# EAGLE design MegaTinyTimeWatch (EAGLE 7.6.0)
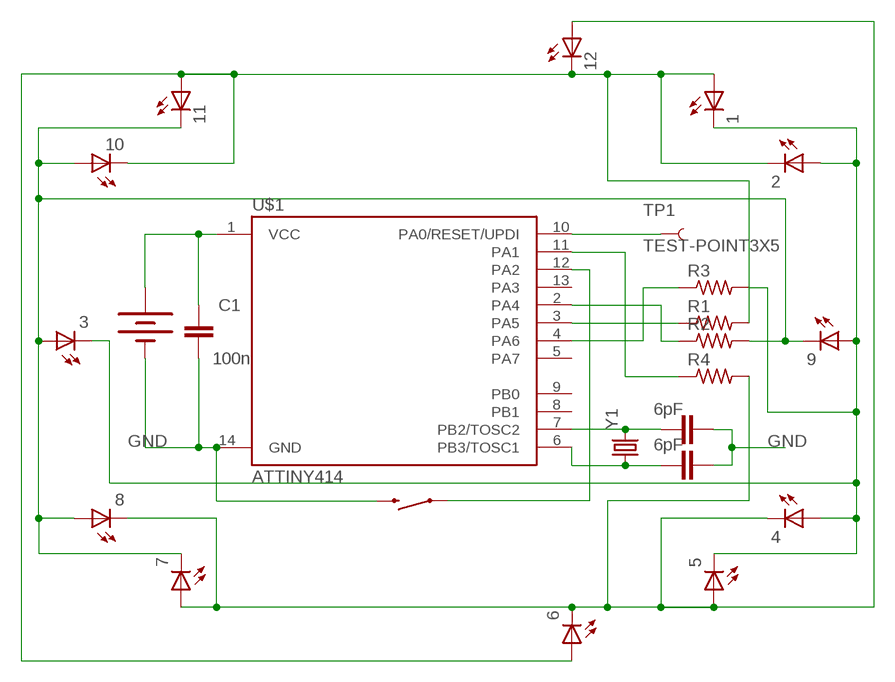
[diagram p0: schematic, sheet 1]

## Parts
1  LEDCHIPLED_0805  [CHIPLED_0805]
2  LEDCHIPLED_0805  [CHIPLED_0805]
3  LEDCHIPLED_0805  [CHIPLED_0805]
4  LEDCHIPLED_0805  [CHIPLED_0805]
5  LEDCHIPLED_0805  [CHIPLED_0805]
6  LEDCHIPLED_0805  [CHIPLED_0805]
7  LEDCHIPLED_0805  [CHIPLED_0805]
8  LEDCHIPLED_0805  [CHIPLED_0805]
9  LEDCHIPLED_0805  [CHIPLED_0805]
10  LEDCHIPLED_0805  [CHIPLED_0805]
11  LEDCHIPLED_0805  [CHIPLED_0805]
12  LEDCHIPLED_0805  [CHIPLED_0805]
BAT1  20mm coincell  BATTERY20MM_4LEGS  [BATTCON_20MM_4LEGS]
C1  100n  CAP0603-CAP  [0603-CAP]
C2  6pF  CAP0603-CAP  [0603-CAP]
C12  6pF  CAP0603-CAP  [0603-CAP]
R1  R-US_M0805  [M0805]
R2  R-US_M0805  [M0805]
R3  R-US_M0805  [M0805]
R4  R-US_M0805  [M0805]
S2  SWITCH-MOMENTARY-2SMD  [TACTILE-SWITCH-SMD]
TP1  TEST-POINT3X5  [PAD.03X.05]
U$1  ATTINY414  [SO14]
Y1  CRYSTAL32-SMD-MELF  [CRYSTAL-32KHZ-SMD-MELF]

## Nets
GND: BAT1.NEGATIVE(-) C1.2 C2.1 C12.1 S2.3 U$1.14(GND)
N$1: 1.C 2.A 3.C 4.A 5.C 9.A R3.2
N$2: 4.C 5.A 6.C 7.A 8.C 12.A R4.2
N$3: 3.A 7.C 8.A 9.C 10.A 11.C R2.2
N$4: 1.A 2.C 6.A 10.C 11.A 12.C R1.2
N$5: R3.1 U$1.4(PA6)
N$6: S2.1 U$1.12(PA2)
N$7: R2.1 U$1.2(PA4)
N$8: R4.1 U$1.11(PA1)
N$9: BAT1.POSITIVE@1(+) BAT1.POSITIVE@2(+) BAT1.POSITIVE@3(+) BAT1.POSITIVE@4(+) C1.1 U$1.1(VCC)
N$10: TP1.P$1 U$1.10(PA0/RESET/UPDI)
N$11: C12.2 U$1.7(PB2/TOSC2) Y1.X2
N$12: R1.1 U$1.3(PA5)
N$14: C2.2 U$1.6(PB3/TOSC1) Y1.X1
Unconnected: U$1.5(PA7) U$1.8(PB1) U$1.9(PB0) U$1.13(PA3)

## Library data of the parts
1-12 = adafruit:LED: LED OSRAM: - CHIPLED LG R971, LG N971, LY N971, LG Q971, LY Q971, LO R971, LY R971 LH N974, LH R974 LS Q976, LO Q976, LY Q976 LO Q996 - Hyper CHIPLED LW Q18S LB Q993, LB Q99A, LB R99A - SideLED LS A670, LO A670, LY A670, LG A670, LP A670 LB A673, LV A673, LT A673, LW A673 LH A674 LY A675 LS A676, LA A676, LO A676, LY A676, LW A676 LS A679, LY A679, LG A679 - Hyper Micro SIDELED® LS Y876, LA Y876, LO Y876, LY Y876 LT Y87S - SmartLED LW L88C, LW L88S LB L89C, LB L89S, LG L890 LS L89K, LO L89K, LY L89K LS L896, LA L896, LO L896, LY L896 - TOPLED LS T670, LO T670, LY T670, LG T670, LP T670 LSG T670, LSP T670, LSY T670, LOP T670, LYG T670 LG T671, LOG T671, LSG T671 LB T673, LV T673, LT T673, LW T673 LH T674 LS T676, LA T676, LO T676, LY T676, LB T676, LH T676, LSB T676, LW T676 LB T67C, LV T67C, LT T67C, LS T67K, LO T67K, LY T67K, LW E67C LS E67B, LA E67B, LO E67B, LY E67B, LB E67C, LV E67C, LT E67C LW T67C LS T679, LY T679, LG T679 LS T770, LO T770, LY T770, LG T770, LP T770 LB T773, LV T773, LT T773, LW T773 LH T774 LS E675, LA E675, LY E675, LS T675 LS T776, LA T776, LO T776, LY T776, LB T776 LHGB T686 LT T68C, LB T68C - Hyper Mini TOPLED® LB M676 - Mini TOPLED Santana® LG M470 LS M47K, LO M47K, LY M47K Source: http://www.osram.convergy.de/
BAT1 = SparkFun-Electromechanical:BATTERY: Battery Holders Various common sizes : AA, AAA, 18650 (PRT-12895), 20mm coin cell and 12mm coin cell. 20MM_4LEGS, BATT-10373; PROD_ID: BATT-10373
C1 C2 C12 = SparkFun-Capacitors:CAP: Capacitor Standard 0603 ceramic capacitor, and 0.1" leaded capacitor.
R1-R4 = adafruit:R-US_: RESISTOR, American symbol
S2 = SparkFun-Electromechanical:SWITCH-MOMENTARY-2: Various NO switches- pushbuttons, reed, etc; PROD_ID: SWCH-08247
TP1 = SparkFun-Passives:TEST-POINT: Bare copper test points for troubleshooting or ICT
U$1 = technoblogy:ATTINY414: Atmel 14-pin 2/4/8kB flash uC; PROD_ID: IC-11285
Y1 = SparkFun-FreqCtrl:CRYSTAL: Various standard crystals. Proven footprints.; PROD_ID: XTAL-07894

## Board
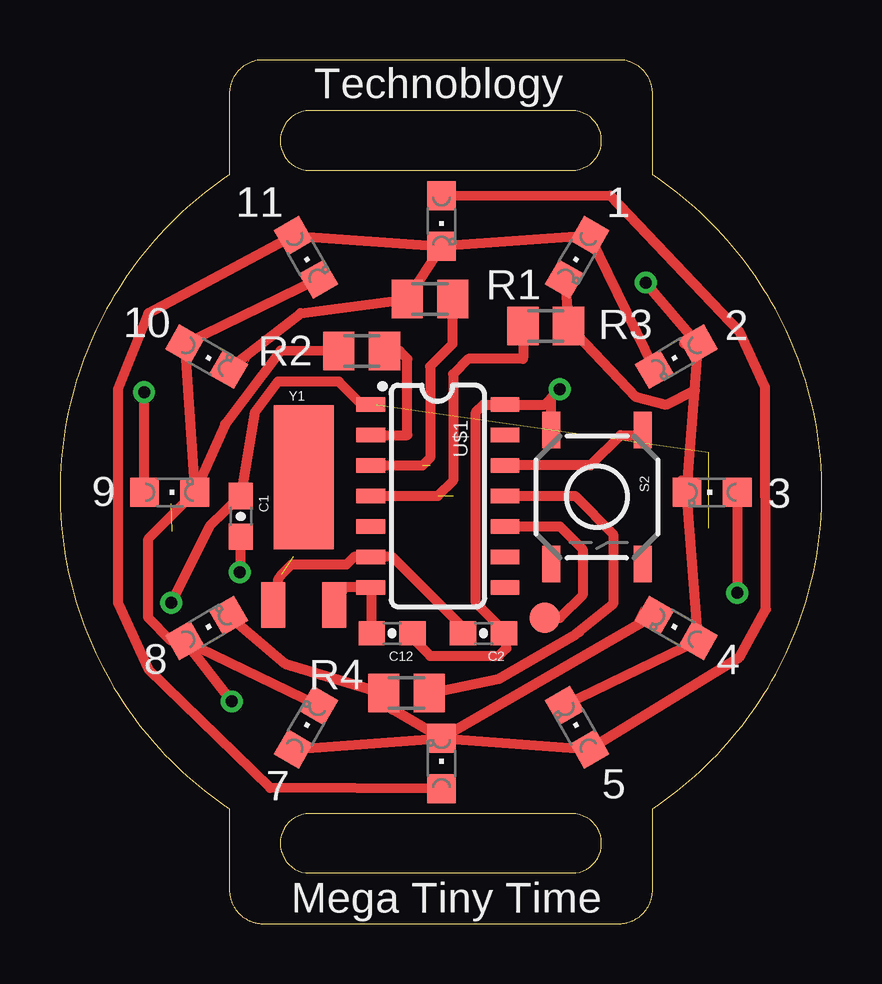
[diagram p1: board, top side]
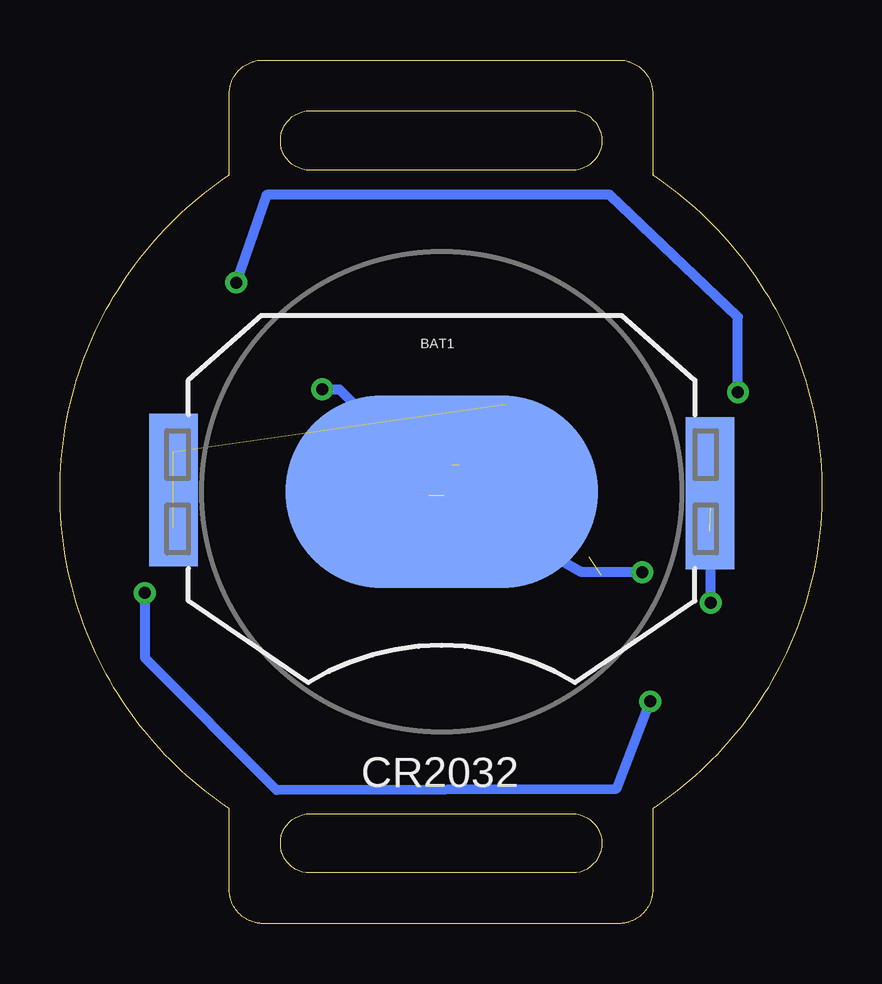
[diagram p2: board, bottom side, seen from below]

Size 31.75 x 35.98 mm. Coordinates in mm from the lower left corner, seen from the top.
Outline: 7.23,0.74 7.2,0.78 7.18,0.82 7.17,0.86 7.15,0.9 7.13,0.95 7.12,0.99 7.11,1.04 7.09,1.08 7.08,1.13 7.08,1.17 7.07,1.22 7.06,1.27 7.06,1.31 7.06,1.36 7.06,4.79 6.79,4.97 6.53,5.15 6.28,5.35 6.02,5.54 5.77,5.74 5.53,5.95 5.29,6.16 5.05,6.37 4.82,6.59 4.6,6.82 4.37,7.05 4.16,7.28 3.94,7.52 3.74,7.76 3.33,8.25 3.14,8.51 2.77,9.03 2.59,9.29 2.42,9.56 2.25,9.84 2.09,10.11 1.78,10.68 1.63,10.96 1.5,11.26 1.36,11.55 1.23,11.85 1.11,12.15 0.99,12.45 0.88,12.75 0.78,13.06 0.68,13.37 0.59,13.69 0.5,14.01 0.42,14.33 0.35,14.65 0.29,14.97 0.22,15.3 0.17,15.63 0.09,16.29 0.05,16.63 0.03,16.97 0.01,17.31 0,17.65 0,18.34 0.01,18.68 0.03,19.02 0.05,19.35 0.09,19.69 0.13,20.02 0.17,20.35 0.22,20.68 0.29,21.01 0.35,21.33 0.42,21.66 0.5,21.98 0.59,22.29 0.68,22.61 0.78,22.92 0.88,23.23 0.99,23.53 1.11,23.84 1.23,24.14 1.36,24.43 1.5,24.73 1.63,25.02 1.78,25.31 1.93,25.59 2.09,25.87 2.25,26.15 2.42,26.42 2.59,26.69 2.77,26.96 3.14,27.48 3.33,27.73 3.53,27.98 3.74,28.23 3.94,28.47 4.16,28.7 4.37,28.94 4.6,29.17 4.82,29.39 5.05,29.61 5.29,29.83 5.53,30.03 5.77,30.24 6.02,30.44 6.28,30.64 6.53,30.83 6.79,31.01 7.06,31.19 7.06,34.62 7.06,34.67 7.06,34.72 7.07,34.76 7.08,34.81 7.08,34.86 7.09,34.9 7.11,34.95 7.12,34.99 7.13,35.04 7.15,35.08 7.17,35.12 7.18,35.16 7.2,35.2 7.23,35.24 7.25,35.28 7.27,35.32 7.3,35.36 7.32,35.4 7.35,35.43 7.38,35.47 7.41,35.5 7.44,35.54 7.5,35.6 7.53,35.63 7.57,35.66 7.6,35.69 7.64,35.72 7.68,35.74 7.72,35.77 7.75,35.79 7.79,35.81 7.83,35.83 7.88,35.85 7.92,35.87 7.96,35.89 8,35.91 8.05,35.92 8.09,35.93 8.14,35.94 8.23,35.96 8.28,35.97 8.32,35.98 8.37,35.98 8.42,35.98 23.33,35.98 23.38,35.98 23.43,35.98 23.48,35.97 23.52,35.96 23.61,35.94 23.66,35.93 23.7,35.92 23.75,35.91 23.79,35.89 23.83,35.87 23.88,35.85 23.92,35.83 23.96,35.81 24,35.79 24.04,35.77 24.07,35.74 24.11,35.72 24.15,35.69 24.18,35.66 24.22,35.63 24.25,35.6 24.28,35.57 24.31,35.54 24.34,35.5 24.37,35.47 24.4,35.43 24.43,35.4 24.45,35.36 24.48,35.32 24.5,35.28 24.52,35.24 24.55,35.2 24.57,35.16 24.58,35.12 24.6,35.08 24.62,35.04 24.63,34.99 24.65,34.95 24.66,34.9 24.67,34.86 24.68,34.81 24.68,34.76 24.69,34.72 24.69,34.67 24.69,34.62 24.69,31.19 24.96,31.01 25.22,30.83 25.48,30.64 25.73,30.44 25.98,30.24 26.46,29.83 26.7,29.61 26.93,29.39 27.15,29.17 27.38,28.94 27.59,28.7 27.81,28.47 28.02,28.23 28.22,27.98 28.42,27.73 28.61,27.48 28.98,26.96 29.16,26.69 29.33,26.42 29.5,26.15 29.66,25.87 29.82,25.59 29.97,25.31 30.12,25.02 30.25,24.73 30.39,24.43 30.52,24.14 30.64,23.84 30.76,23.53 30.87,23.23 30.97,22.92 31.07,22.61 31.16,22.29 31.25,21.98 31.33,21.66 31.4,21.33 31.46,21.01 31.53,20.68 31.58,20.35 31.62,20.02 31.66,19.69 31.7,19.35 31.74,18.68 31.75,18.34 31.75,17.65 31.74,17.31 31.7,16.63 31.66,16.29 31.58,15.63 31.53,15.3 31.46,14.97 31.4,14.65 31.33,14.33 31.25,14.01 31.16,13.69 31.07,13.37 30.97,13.06 30.87,12.75 30.76,12.45 30.64,12.15 30.52,11.85 30.39,11.55 30.25,11.26 30.12,10.96 29.97,10.68 29.82,10.39 29.66,10.11 29.5,9.84 29.33,9.56 29.16,9.29 28.98,9.03 28.61,8.51 28.42,8.25 28.22,8.01 28.02,7.76 27.81,7.52 27.59,7.28 27.38,7.05 27.15,6.82 26.93,6.59 26.7,6.37 26.46,6.16 25.98,5.74 25.73,5.54 25.48,5.35 25.22,5.15 24.96,4.97 24.69,4.79 24.69,1.36 24.69,1.31 24.69,1.27 24.68,1.22 24.68,1.17 24.67,1.13 24.66,1.08 24.65,1.04 24.63,0.99 24.62,0.95 24.6,0.9 24.58,0.86 24.57,0.82 24.55,0.78 24.52,0.74 24.5,0.7 24.48,0.66 24.45,0.62 24.43,0.58 24.4,0.55 24.37,0.51 24.34,0.48 24.31,0.45 24.28,0.41 24.25,0.38 24.22,0.35 24.18,0.32 24.15,0.29 24.11,0.27 24.07,0.24 24.04,0.22 24,0.19 23.96,0.17 23.92,0.15 23.88,0.13 23.83,0.11 23.79,0.09 23.75,0.08 23.66,0.05 23.61,0.04 23.57,0.03 23.52,0.02 23.48,0.01 23.43,0.01 23.38,0 23.33,0 8.42,0 8.37,0 8.32,0.01 8.28,0.01 8.23,0.02 8.18,0.03 8.14,0.04 8.09,0.05 8.05,0.06 8,0.08 7.96,0.09 7.92,0.11 7.88,0.13 7.83,0.15 7.79,0.17 7.75,0.19 7.72,0.22 7.68,0.24 7.64,0.27 7.6,0.29 7.57,0.32 7.53,0.35 7.5,0.38 7.47,0.41 7.44,0.45 7.41,0.48 7.38,0.51 7.35,0.55 7.32,0.58 7.3,0.62 7.27,0.66 7.25,0.7
Outline: 21.5,33.86 10.24,33.86 10.08,33.82 9.93,33.76 9.79,33.7 9.65,33.61 9.54,33.5 9.43,33.39 9.34,33.25 9.28,33.11 9.21,32.96 9.18,32.79 9.18,32.45 9.21,32.29 9.28,32.14 9.34,32 9.43,31.86 9.54,31.75 9.65,31.64 9.79,31.55 9.93,31.49 10.08,31.42 10.24,31.39 21.5,31.39 21.66,31.42 21.81,31.49 21.96,31.55 22.09,31.64 22.2,31.75 22.31,31.86 22.4,32 22.47,32.14 22.53,32.29 22.56,32.45 22.56,32.79 22.53,32.96 22.47,33.11 22.4,33.25 22.31,33.39 22.2,33.5 22.09,33.61 21.96,33.7 21.81,33.76 21.66,33.82 21.5,33.86
Outline: 21.5,4.58 10.24,4.58 10.08,4.55 9.93,4.48 9.79,4.42 9.65,4.33 9.54,4.22 9.43,4.11 9.34,3.97 9.28,3.83 9.21,3.68 9.18,3.52 9.18,3.17 9.21,3.01 9.28,2.86 9.34,2.72 9.43,2.58 9.54,2.47 9.65,2.36 9.79,2.27 9.93,2.21 10.08,2.15 10.24,2.11 21.5,2.11 21.66,2.15 21.81,2.21 21.96,2.27 22.09,2.36 22.2,2.47 22.31,2.58 22.4,2.72 22.47,2.86 22.53,3.01 22.56,3.17 22.56,3.52 22.53,3.68 22.47,3.83 22.4,3.97 22.31,4.11 22.2,4.22 22.09,4.33 21.96,4.42 21.81,4.48 21.66,4.55 21.5,4.58
Copper layers (1*16): Top 0.035mm / dielectric 1.5mm / Bottom 0.035mm
Design rules "default *": minimum track width 10mil, minimum drill 24mil, track to track 8mil, track to pad 8mil, pad to pad 8mil, via to via 8mil, smd to smd 8mil, copper to edge 40mil, drill to drill 8mil, minimum pad ring 10mil, minimum via ring 8mil, stop-mask expansion 4mil, vias tented up to drill 20mil, thermal gap 10mil

### Footprints (pad centres in the part's own frame; a part is rotated, then mirrored left to right if it is on the bottom)
CHIPLED_0805 = smd 1.2 x 1.2: A 0,-1.05; C 0,1.05
BATTCON_20MM_4LEGS = smd 13 x 8: NEGATIVE 0,0 | smd 2.032 x 3.175: POSITIVE@1 -11.176,1.651; POSITIVE@2 -11.176,-1.524; POSITIVE@3 11.176,1.524; POSITIVE@4 11.176,-1.651
0603-CAP = smd 1.1 x 1: 1 -0.85,0; 2 0.85,0
M0805 = smd 1.3 x 1.6: 1 -0.95,0; 2 0.95,0
TACTILE-SWITCH-SMD = smd 1.524 x 0.762: 1 -2.794,1.905; 2 2.794,1.905; 3 -2.794,-1.905; 4 2.794,-1.905
PAD.03X.05 = smd 1.27 x 1.27: P$1 0,0
SO14 = smd 0.6 x 1.2: 1 -3.81,-2.8; 2 -2.54,-2.8; 3 -1.27,-2.8; 4 0,-2.8; 5 1.27,-2.8; 6 2.54,-2.8; 7 3.81,-2.8; 8 3.81,2.8; 9 2.54,2.8; 10 1.27,2.8; 11 0,2.8; 12 -1.27,2.8; 13 -2.54,2.8; 14 -3.81,2.8
CRYSTAL-32KHZ-SMD-MELF = smd 2.5 x 6: SHEILD 0,5.08 | smd 1.016 x 1.905: X1 -1.27,-0.254; X2 1.27,-0.254

### Placement (x,y rotation side)
1  21.55,27.76 150 top
2  25.69,23.62 120 top
3  27.17,17.97 90 top
4  25.69,12.32 60 top
5  21.55,8.18 30 top
6  15.9,6.67 0 top
7  10.25,8.18 330 top
8  6.11,12.32 300 top
9  4.57,17.97 270 top
10  6.11,23.62 240 top
11  10.25,27.76 210 top
12  15.9,29.27 180 top
BAT1  15.85,18 0 bottom
C1  7.53,16.97 270 top
C2  17.65,12.1 180 top
C12  13.84,12.1 180 top
R1  15.41,26.02 180 top
R2  12.57,23.85 180 top
R3  20.24,24.9 0 top
R4  14.44,9.6 180 top
S2  22.37,17.78 270 top
TP1  20.19,12.74 0 top
U$1  15.74,17.82 270 top
Y1  10.16,13.53 0 top

### Tracks (layer width: path | path; a pad name or v marks a point on that pad's centre or on a via)
GND  (via drill 0.5)
  Top 0.406: C12.1 14.69,11.89 15.43,11.15 18.28,11.15 18.6,11.47 18.6,12 C2.1 18.5,12.2 17.33,13.37 17.33,21.31 17.65,21.63 U$1.14 20.19,21.63 v20.82,22.26 20.47,21.91 S2.3 | C1.2 v7.49,14.64
  Bottom 0.406: v20.82,22.26 20.11,22.26 BAT1.NEGATIVE 10.03,14.64 v7.49,14.64
N$1  (via drill 0.5)
  Top 0.406: 26,24.17 2.A | 9.A v3.5,22.14 | 2.A v24.41,26.71 | 5.C 4.A 3.C | 1.C R3.2 24,21.94 25.27,21.63 26.45,22.22 | 3.C 26.45,22.22 | 26.45,22.22 2.A | 25.9,18.45 3.C
  Bottom 0.406: v3.5,22.14 3.5,25.29 8.84,30.37 23.14,30.37 v24.41,26.71
N$2
  Top 0.406: 12.A 22.93,30.34 28.32,24.65 29.38,22.34 29.41,13.09 28.29,11.09 5.A 6.C | 4.C 6.C | 8.C 9.39,10.83 R4.2 13.84,8.93 6.C | 7.A 6.C
N$3  (via drill 0.5)
  Top 0.406: 8.A 7.C | 9.C 5.79,17.97 | 9.C 10.A 11.C | 3.A v28.22,13.78 | v7.16,9.26 8.A | R2.2 9.19,23.88 6.88,20.81 9.C | 8.A 4.62,11.79 3.68,12.74 3.68,16.03 9.C
  Bottom 0.406: v28.22,13.78 28.22,11.09 22.73,5.57 8.56,5.63 v7.16,9.26
N$4
  Top 0.406: 12.C 11.A 3.68,25.44 2.41,22.26 2.41,13.37 3.68,10.6 8.76,5.65 6.A | 12.C 1.A 2.C | 12.C R1.2 10.03,25.44 10.C
N$5  (1 unrouted)
  Top 0.406: R3.1 19.3,23.58 19.3,23.53 17.01,23.53 16.38,22.9 16.38,18.45 15.74,17.82 U$1.4
N$6
  Top 0.406: U$1.12 22.09,19.09 23.36,20.36 24.06,20.36 S2.1
N$7
  Top 0.406: U$1.2 14.47,20.36 14.47,23.53 14.16,23.85 R2.1
N$8
  Top 0.406: R4.1 18.28,10.2 21.48,12.06 | 21.48,12.06 21.64,12.15 | U$1.11 21.46,17.82 23.05,16.23 23.05,13.31 21.48,12.06
N$9  (via drill 0.5)  (3 unrouted)
  Top 0.406: 13.2,21.63 U$1.1 12.57,21.63 11.62,22.58 9.08,22.58 8.12,21.31 C1.1 6.22,16.55 v4.63,13.37
  Bottom 0.406: v4.63,13.37 4.63,17.5 4.95,17.82 4.95,19.24 BAT1.POSITIVE@3
N$10
  Top 0.406: U$1.10 20.82,16.55 21.78,15.59 21.78,13.69 20.82,12.74 TP1.P$1
N$11
  Top 0.406: C12.2 12.99,13.96 U$1.7 11.85,14.01 Y1.X2
N$12  (1 unrouted)
  Top 0.406: U$1.3 15.11,19.09 15.43,19.41 15.43,23.21 16.36,24.15 R1.1
N$14  (1 unrouted)
  Top 0.406: Y1.X1 9.08,13.78 9.08,14.32 9.22,14.54 9.64,14.96 11.93,14.96 12.25,15.28 U$1.6 13.84,15.28 16.8,12.32 C2.2
N$50
  Top 0: 7.53,22.81 8.13,23.97
N$55
  Top 0: 24.22,13.17 23.62,12.01

### Text on the board
tNames: Technoblogy | Mega Tiny Time
bNames: CR2032